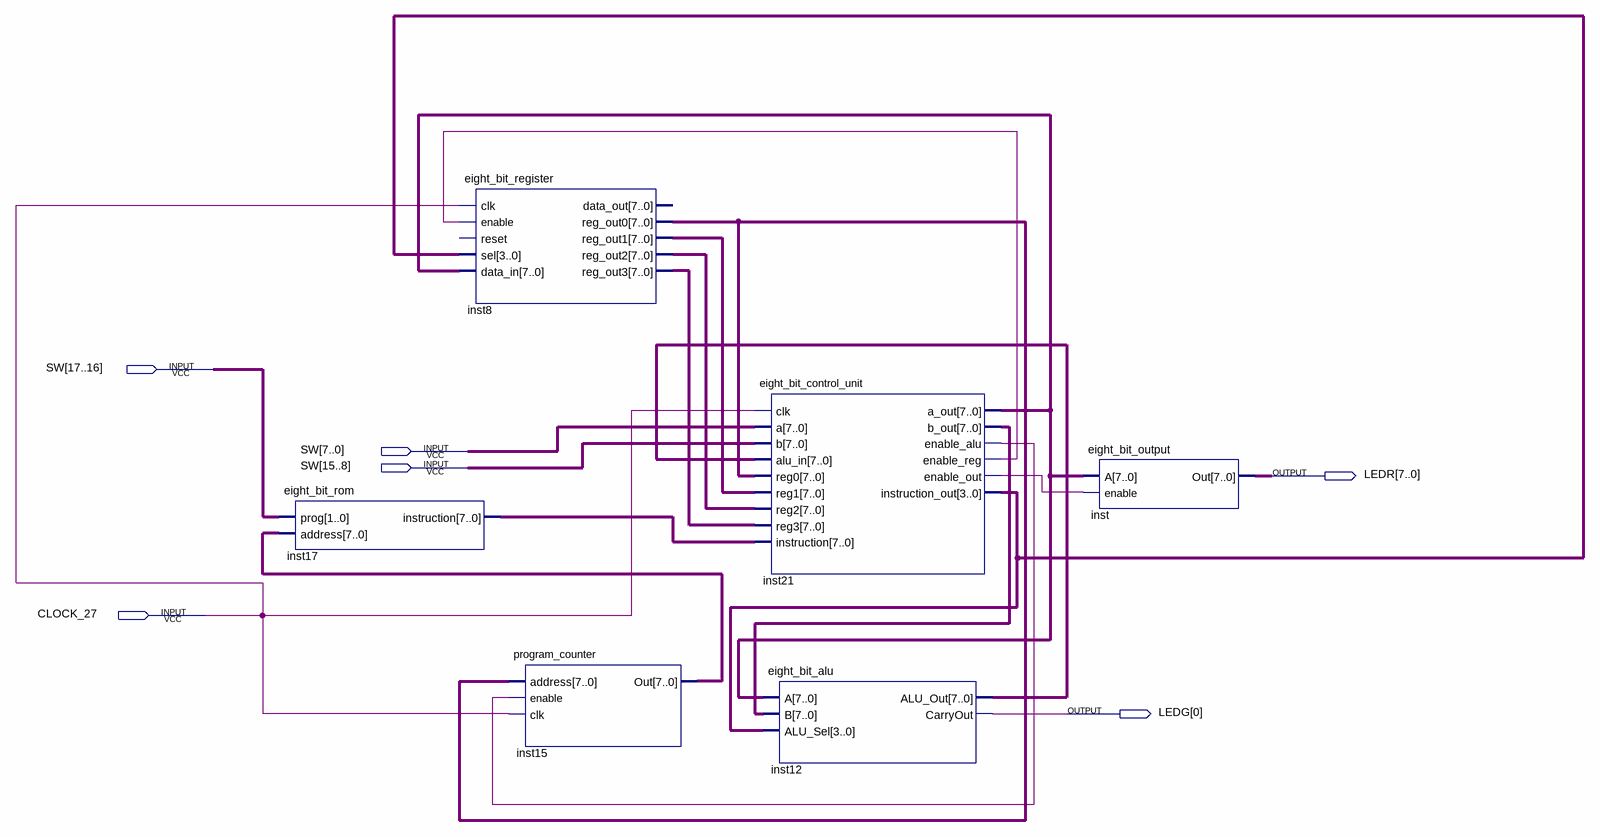
[diagram p0: schematic sheet]
// Quartus schematic processor.bdf as structural Verilog: 6 symbols, 6 pins
module processor (
  input  [17:0] SW,
  input  CLOCK_27,
  output [7:0] LEDR,
  output [0:0] LEDG
);

  wire inst21_enable_alu, inst21_enable_out, inst21_enable_reg;
  wire [3:0] inst21_instruction_out;
  wire [7:0] inst8_reg_out0, inst8_reg_out1, inst8_reg_out2, inst8_reg_out3, inst12_alu_out, inst15_out,
       inst17_instruction, inst21_a_out, inst21_b_out;

  eight_bit_rom inst17 (.prog(SW[17:16]), .address(inst15_out), .instruction(inst17_instruction));
  eight_bit_register inst8 (
    .clk(CLOCK_27), .enable(inst21_enable_reg), .sel(inst21_instruction_out), .data_in(inst21_a_out),
    .reg_out0(inst8_reg_out0), .reg_out1(inst8_reg_out1), .reg_out2(inst8_reg_out2), .reg_out3(inst8_reg_out3));  // open: reset, data_out
  program_counter inst15 (.address(inst8_reg_out0), .enable(inst21_enable_alu), .clk(CLOCK_27), .Out(inst15_out));
  eight_bit_control_unit inst21 (
    .clk(CLOCK_27), .a(SW[7:0]), .b(SW[15:8]), .alu_in(inst12_alu_out), .reg0(inst8_reg_out0),
    .reg1(inst8_reg_out1), .reg2(inst8_reg_out2), .reg3(inst8_reg_out3), .instruction(inst17_instruction),
    .a_out(inst21_a_out), .b_out(inst21_b_out), .enable_alu(inst21_enable_alu),
    .enable_reg(inst21_enable_reg), .enable_out(inst21_enable_out), .instruction_out(inst21_instruction_out));
  eight_bit_alu inst12 (
    .A(inst21_a_out), .B(inst21_b_out), .ALU_Sel(inst21_instruction_out), .ALU_Out(inst12_alu_out),
    .CarryOut(LEDG[0]));
  eight_bit_output inst (.A(inst21_a_out), .enable(inst21_enable_out), .Out(LEDR));
endmodule
